# Altium project Transmitter.PrjPcb
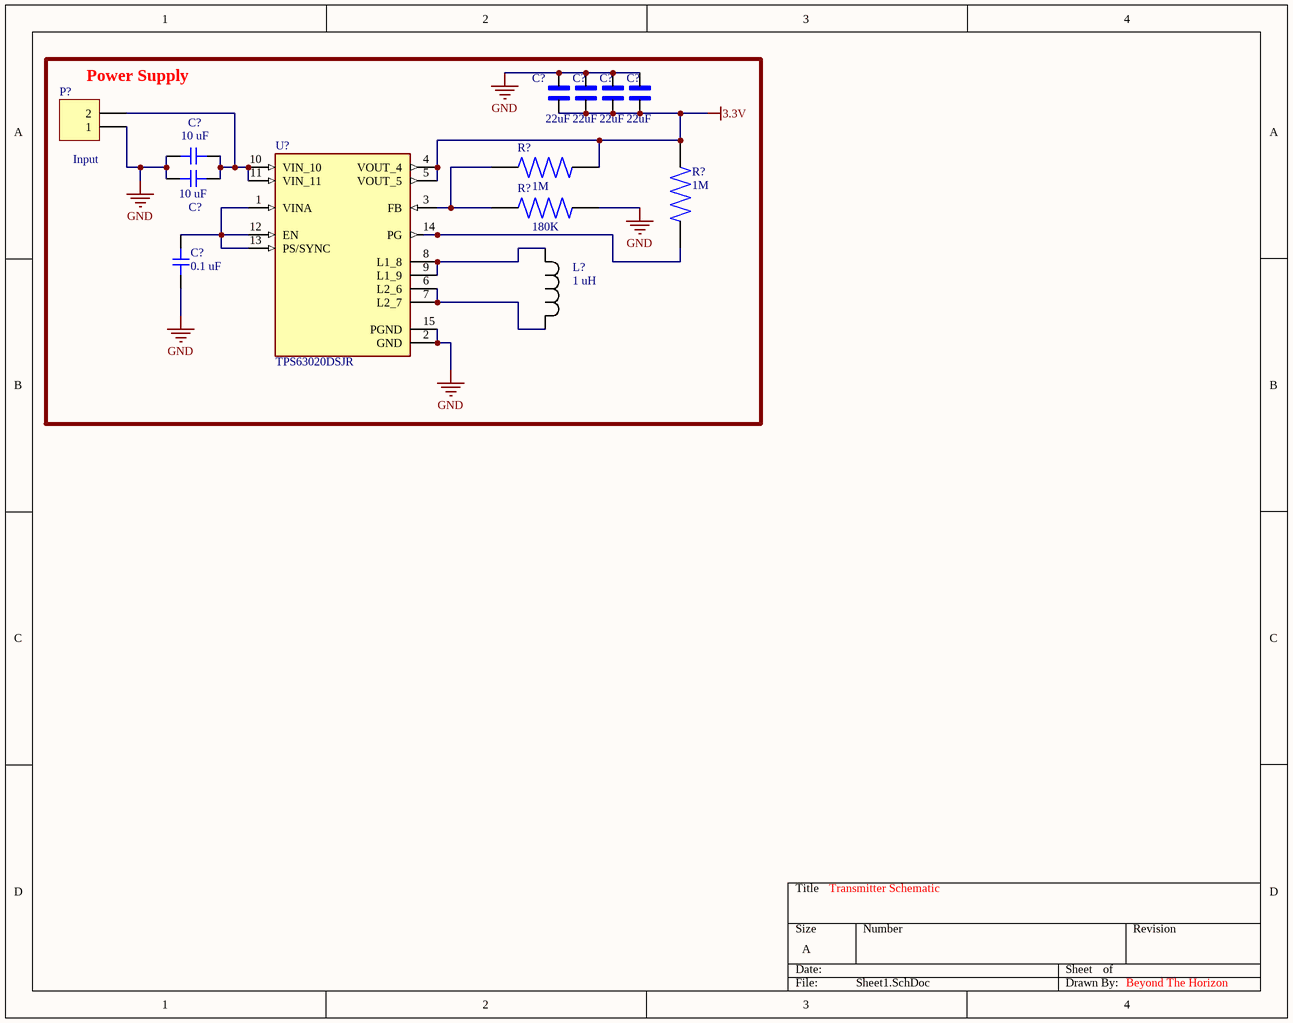
[diagram p0: Sheet1.SchDoc]
1 sheet, 13 parts. Net scope: global (net labels, ports and power ports of the same name join across sheets).

## Sheet Sheet1.SchDoc
size A; SheetNumber: 1; SheetTotal: 1

### Parts
(Parts that share a designator on the sheet are numbered #1, #2 ... from top to bottom, then left to right.)
C?#1  22uF  [CAPC1608X100N]
C?#2  22uF  [CAPC1608X100N]
C?#3  22uF  [CAPC1608X100N]
C?#4  22uF  [CAPC1608X100N]
C?#5  10 uF  [CAPC3216X120N]
C?#6  10 uF  [CAPC3216X120N]
C?#7  0.1 uF  [CAPC3216X120N]
L?  1 uH  [IND_TMPC0603HV_TTA]
P?  Input  [HDR1X2]
R?#1  1M  [RESC3116X65N]
R?#2  1M  [RESC3116X65N]
R?#3  180K  [RESC3116X65N]
U?  TPS63020DSJR  [IC_TPS63020DSJR]

### Blocks framed on the sheet
Power Supply: C?#1-C?#7 L? P? R?#1-R?#3 U?

### Nets
3.3V: C?#1.1 C?#2.1 C?#3.1 C?#4.1 R?#1.2 R?#2.2 U?.4(VOUT_4) U?.5(VOUT_5)
GND: C?#1.2 C?#2.2 C?#3.2 C?#4.2 C?#5.2(B) C?#6.2(B) C?#7.1(A) P?.1 R?#3.2 U?.2(GND) U?.15(PGND)
NetC?#5_1: C?#5.1(A) C?#6.1(A) P?.2 U?.10(VIN_10) U?.11(VIN_11)
NetC?#7_2: C?#7.2(B) U?.1(VINA) U?.12(EN) U?.13(PS/SYNC)
NetL?_1: L?.1 U?.6(L2_6) U?.7(L2_7)
NetL?_2: L?.2 U?.8(L1_8) U?.9(L1_9)
NetR?#1_1: R?#1.1 R?#3.1 U?.3(FB)
NetR?#2_1: R?#2.1 U?.14(PG)

### Notes on the sheet
- Transmitter Schematic
- Beyond The Horizon

### Library data of the parts
C?#1-C?#4 = GRM188R61A226ME15D: SMD capacitor X5R(EIA) with capacitance 22uF Tol.20%. Rated voltage 10Vdc 85C; MF: Murata Electronics; SnapEDA_Link: https://www.snapeda.com/parts/GRM188R61A226ME15D/Murata+Electronics+North+America/view-part/?ref=snap; Package: 1608 Murata; Value: *; MP: GRM188R61A226ME15D; Check_prices: https://www.snapeda.com/parts/GRM188R61A226ME15D/Murata+Electronics+North+America/view-part/?ref=eda
C?#5-C?#7 = C1206C105K5RACTU: 1206 C 1uF Ceramic Multilayer Capacitor, 50 VDC, +125degC, X7R Dielec, +/-10% | KEMET C1206C105K5RACTU; SnapEDA_Link: https://www.snapeda.com/parts/C1206C105K5RACTU/KEMET/view-part/?ref=snap; Package: 1206-2 KEMET; Value: *; MF: KEMET; MP: C1206C105K5RACTU; Check_prices: https://www.snapeda.com/parts/C1206C105K5RACTU/KEMET/view-part/?ref=eda
L? = TMPC 0603HV-3R3MG-D: Description; Manufacturer_Name: Tai Tech; Copyright: Copyright (C) 2025 Ultra Librarian. All rights reserved.; Manufacturer_Part_Number: TMPC 0603HV-3R3MG-D
P? = Header 2: Header, 2-Pin; LatestRevisionDate: 17-Jul-2002; LatestRevisionNote: Re-released for DXP Platform.; Publisher: Altium Limited
R?#1-R?#3 = RC1206JR-0713RL: 13 Ohms Â±5% 0.25W, 1/4W Chip Resistor 1206 (3216 Metric) Moisture Resistant Thick Film; MF: Yageo; Check_prices: https://www.snapeda.com/parts/RC1206JR-0713RL/Yageo/view-part/?ref=eda; Value: *; Availability: In Stock; MP: RC1206JR-0713RL; Price: None; Package: 3116 Yageo; SnapEDA_Link: https://www.snapeda.com/parts/RC1206JR-0713RL/Yageo/view-part/?ref=snap; Purchase-URL: https://pricing.snapeda.com/search/part/RC1206JR-0713RL/?ref=eda
U? = TPS63020DSJR: High Efficiency Single Inductor Buck-Boost Converter with 4A Switch; MF: Texas Instruments; SnapEDA_Link: https://www.snapeda.com/parts/TPS63020DSJR/Texas+Instruments/view-part/?ref=snap; Package: VSON-14 Texas Instruments; Value: *; MP: TPS63020DSJR; Check_prices: https://www.snapeda.com/parts/TPS63020DSJR/Texas+Instruments/view-part/?ref=eda